# EAGLE design WHRL (EAGLE 7.4.0)
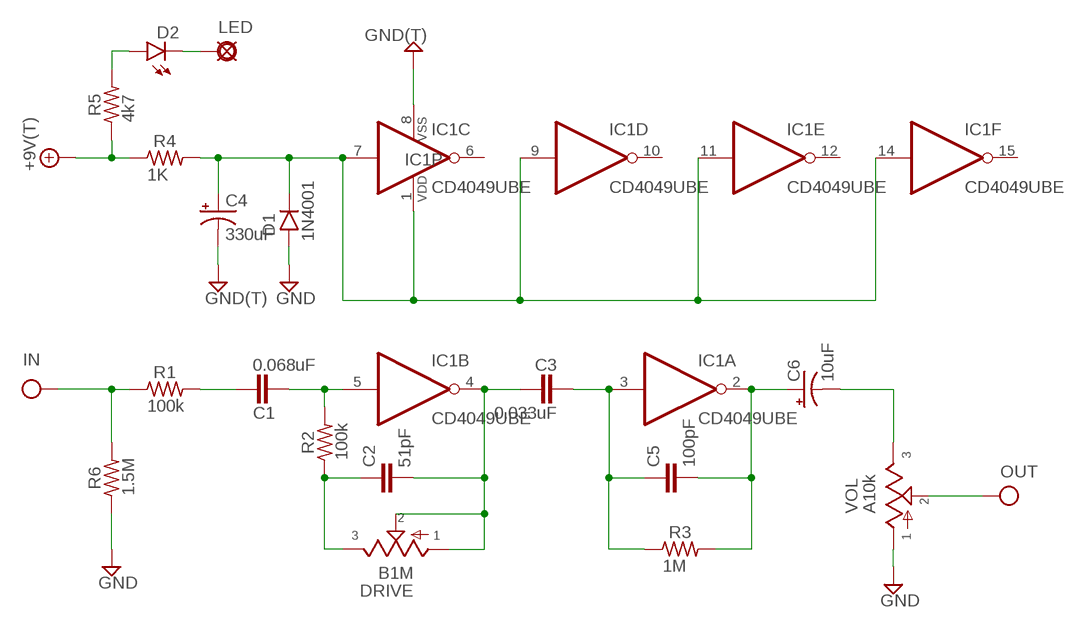
[diagram p0: schematic, sheet 1]

## Parts
+9V  +9V(T)  [SQUARE]
C1  0.068uF  072X0352  [072X035]
C2  51pF  050X030_0251  [050X030_025]
C3  0.033uF  072X0252  [072X025]
C4  330uF  0801  [080_035_1]
C5  100pF  050X030_0251  [050X030_025]
C6  10uF  0501  [050_020_1]
D1  1N4001  1N400X.2  [DO41-2]
D2  LED3MM  [LED3MM]
DRIVE  B1M  9MMPOT_9MM_HOLES  [POT_9MM_HOLES]
G  GND(T)  [SQUARE]
G2  GND(T)  [SQUARE]
IC1  CD4049UBE  [DIL16]
IN  IN(T)  [SQUARE]
LED  PAD  [SQUARE]
OUT  OUT(T)  [SQUARE]
R1  100k  3MM.2  [R0204/2]
R2  100k  3MM.2  [R0204/2]
R3  1M  3MM.2  [R0204/2]
R4  1K  3MM.2  [R0204/2]
R5  4k7  3MM.2  [R0204/2]
R6  1.5M  3MM.2  [R0204/2]
VOL  A10k  9MMPOT_9MM_HOLES  [POT_9MM_HOLES]

## Nets
+9V: +9V.1(+9V) R4.1 R5.1
GND: C4.- D1.A G2.1(GND) G.1(GND) IC1.8(P:VSS) R6.1 VOL.P$1
IN: IN.1(IN) R1.1 R6.2
N$1: C4.+ D1.C IC1.1(P:VDD) IC1.7(C:I) IC1.9(D:I) IC1.11(E:I) IC1.14(F:I) R4.2
N$2: D2.K(C) LED.1(PAD)
N$3: D2.A R5.2
N$4: C1.2 R1.2
N$5: C1.1 IC1.5(B:I) R2.2
N$6: C2.2 C3.1 DRIVE.P$1 DRIVE.P$2 IC1.4(B:O)
N$7: C3.2 C5.1 IC1.3(A:I) R3.1
N$8: C5.2 C6.+ IC1.2(A:O) R3.2
N$9: C6.- VOL.P$3
N$10: OUT.1(OUT) VOL.P$2
N$11: C2.1 DRIVE.P$3 R2.1
Unconnected: IC1.6(C:O) IC1.10(D:O) IC1.12(E:O) IC1.15(F:O)

## Library data of the parts
+9V = mb_supply:+9V(T): +9V Voltage Supply use this to hook up +9v throughout a schematic instead of running wire automatically labels the net "+9v" adds a hookup pad to the circuit board
C1 = mb_caps-box:072X035: 0.15 - 1.0uF; WIMA MKP2 63, 100V: 0.047uF; MKS2 50V: 0.68 - 1.0uF; 63V: 0.33 - 0.47uF; 100V: 0.15 - 0.22uF;
C2 C5 = mb_caps-ceramic:050X030_025: 47 - 120pF Xicon Ceramic Disc 2.5mm lead spacing
C3 = mb_caps-box:072X025: 1000pF - 0.47uF WIMA MKP2 63, 100V: 1000pF - 0.015uF; MKS2 50V: 0.33 - 0.47uF; 63V: 1000pF - 0.22uF;
C4 = mb_caps-electro:080: 47 - 470uF Xicon values at Mouser.com 10V: 330, 470uF; 16V: 220, 330uF; 25V: 220uF; 50V: 47, 100uF
C6 = mb_caps-electro:050: 0.22 - 100uF Xicon values at Mouser.com: 10V: 10 - 100uF; 16V: 2.2 - 47uF; 25V: 0.47 - 47uF; 50V: 0.22 - 22uF
D1 = mb_diodes:1N400X: Rectifier Diodes often used in power supply to prevent damage from reverse polarization
D2 = mb_diodes:LED
DRIVE VOL = mb_9mm Pot:9MM
G G2 = mb_supply:GND(T): Ground use this to hook up ground (GND) throughout a schematic instead of running wire automatically labels the net "GND" adds a hookup pad to the circuit board (you can use several)
IC1 = mb_ics:CD4049UBE: Hex Inverting Buffer Used, for example, in the Red Llama, Three Legged Dog, and Hot Harmonics.
IN = mb_supply:IN(T): Input obsolete: use Pad instead and label net shematic input label with circuit board terminal/pad generally used only once on a schematic (because this device labels the net "IN" in the same way as a voltage supply or ground net)
LED = mb_supply:PAD: PAD use this package for pads with any purpose, including input, output, send or return various pad shapes: round, square, octogonal, long, and long offset
OUT = mb_supply:OUT(T): Output obsolete: use Pad instead and label net output label with circuit board terminal/pad usually appears only once on a schematic
R1-R6 = mb_resistors:3MM: 3mm Resistors Leads spaced 1-6 holes apart for 0.1" perfboard. Suitable for 1/8 watt resistors.

## Board
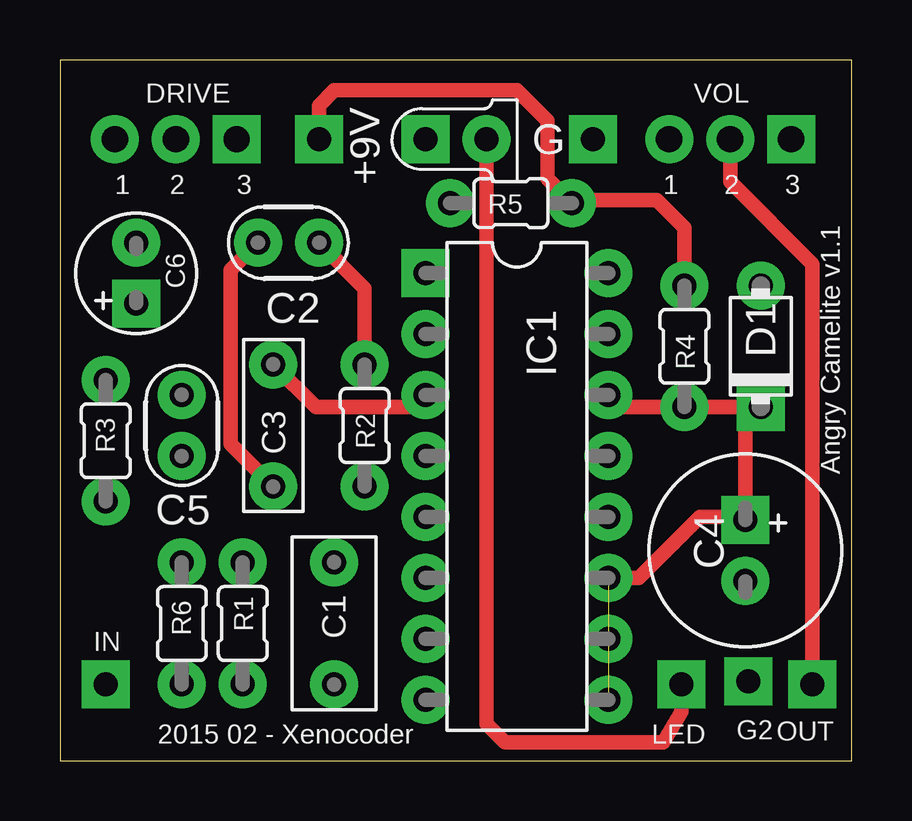
[diagram p1: board, top side]
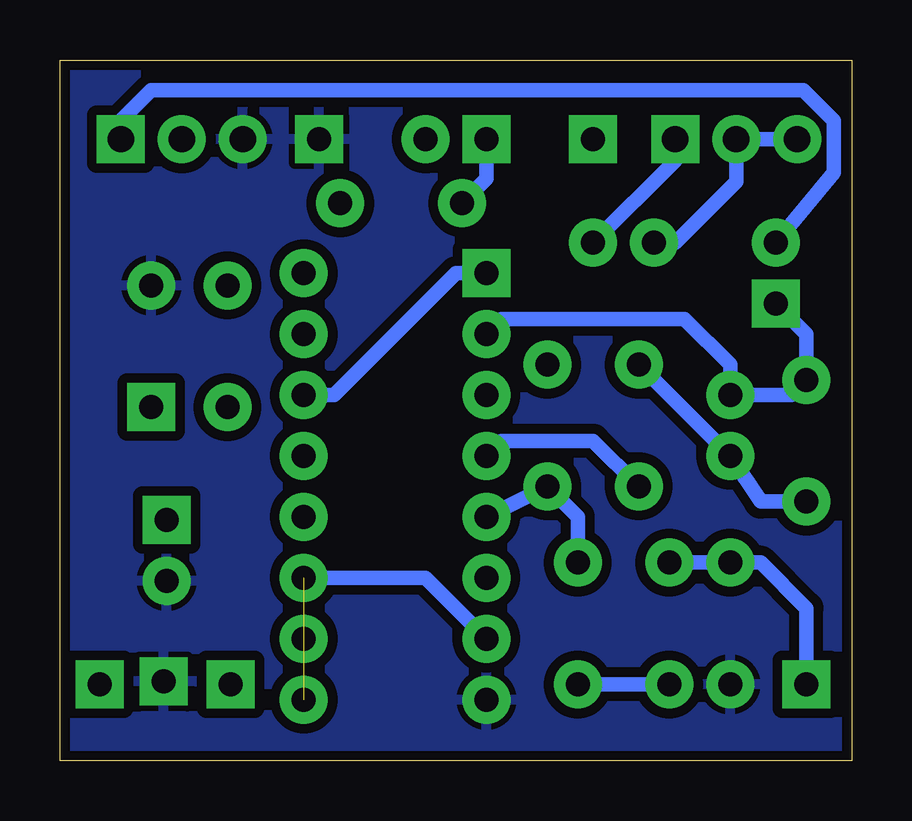
[diagram p2: board, bottom side, seen from below]

Size 33.02 x 29.21 mm. Coordinates in mm from the lower left corner, seen from the top.
Outline: 0,0 33.02,0 33.02,29.21 0,29.21 0,0
Copper layers (1*16): Top 0.0356mm / dielectric 1.5011mm / Bottom 0.0356mm
Design rules "LaenPCBOrder": minimum track width 6mil, minimum drill 13mil, track to track 6mil, track to pad 6mil, pad to pad 6mil, via to via 6mil, smd to smd 6mil, copper to edge 15mil, drill to drill 6mil, minimum pad ring 7mil, minimum via ring 7mil, stop-mask expansion 3mil, vias tented up to drill 0mil, thermal gap 10mil

### Footprints (pad centres in the part's own frame; a part is rotated, then mirrored left to right if it is on the bottom)
SQUARE = drill 1 pad 2 square: 1 0,0
072X035 = drill 1 pad 2: 1 -2.54,0; 2 2.54,0
050X030_025 = drill 1 pad 2: 1 -1.27,0; 2 1.27,0
072X025 = drill 1 pad 2: 1 -2.54,0; 2 2.54,0
080_035_1 = drill 1 pad 2 square: + -1.27,0 | drill 1 pad 2: - 1.27,0
050_020_1 = drill 1 pad 2 square: + -1.27,0 | drill 1 pad 2: - 1.27,0
DO41-2 = drill 1 pad 2: A 2.54,0 | drill 1 pad 2 square: C -2.54,0
LED3MM = drill 1 pad 2 square: A -1.27,0 | drill 1 pad 2: K 1.27,0
POT_9MM_HOLES = drill 1.1 pad 2: P$1 -2.54,0; P$2 0,0 | drill 1.1 pad 2 square: P$3 2.54,0
DIL16 = drill 1 pad 2 square: 1 -8.89,-3.81 | drill 1 pad 2: 2 -6.35,-3.81; 3 -3.81,-3.81; 4 -1.27,-3.81; 5 1.27,-3.81; 6 3.81,-3.81; 7 6.35,-3.81; 8 8.89,-3.81; 9 8.89,3.81; 10 6.35,3.81; 11 3.81,3.81; 12 1.27,3.81; 13 -1.27,3.81; 14 -3.81,3.81; 15 -6.35,3.81; 16 -8.89,3.81
R0204/2 = drill 1 pad 2: 1 -2.54,0; 2 2.54,0

### Placement (x,y rotation side)
+9V  10.79,25.91 0 top
C1  11.43,5.71 270 top
C2  9.53,21.59 180 top
C3  8.89,13.97 90 top
C4  28.57,8.76 270 top
C5  5.08,13.97 90 top
C6  3.17,20.32 90 top
D1  29.21,17.27 90 top
D2  16.51,25.91 0 top
DRIVE  4.83,25.91 0 top
G  22.23,25.91 0 top
G2  28.7,3.3 0 top
IC1  19.05,11.43 270 top
IN  1.91,3.17 0 top
LED  25.91,3.17 0 top
OUT  31.37,3.17 0 top
R1  7.62,5.71 270 top
R2  12.7,13.97 270 top
R3  1.91,13.34 90 top
R4  26.04,17.27 270 top
R5  18.8,23.24 180 top
R6  5.08,5.71 90 top
VOL  27.94,25.91 0 top

### Tracks (layer width: path | path; a pad name or v marks a point on that pad's centre or on a via)
+9V
  Top 0.61: +9V.1 10.79,27.3 11.43,27.94 19.05,27.94 20.32,26.67 20.32,24.26 R5.1 21.46,23.37 24.89,23.37 26.04,22.23 R4.1
GND
  pour Bottom (isolate 0.406): 0,29.21 33.02,29.21 33.02,0 0,0
IN
  Bottom 0.61: R1.1 R6.2 3.81,8.26 1.91,6.35 IN.1
N$1  (1 unrouted)
  Top 0.61: IC1.14 23.37,14.73 R4.2 D1.C 28.57,14.1 C4.+ 28.45,10.16 26.67,10.16 24.13,7.62 IC1.11
  Bottom 0.61: IC1.7 17.78,7.62 IC1.11 | IC1.1 16.51,20.32 21.59,15.24 IC1.14
N$2
  Top 0.61: LED.1 25.91,2.03 25.15,0.76 18.54,0.76 17.78,1.52 D2.K
N$3
  Bottom 0.61: D2.A 15.24,24.26 R5.2
N$4
  Bottom 0.61: R1.2 C1.2
N$5
  Bottom 0.61: C1.1 11.43,10.16 R2.2 IC1.5
N$6
  Top 0.61: C2.2 7.11,20.45 7.11,13.21 C3.1
  Bottom 0.61: C3.1 10.79,13.34 14.61,13.34 IC1.4 | DRIVE.P$1 DRIVE.P$2 4.83,24.13 7.37,21.59 C2.2
N$7
  Top 0.61: C3.2 10.67,14.73 14.73,14.73 IC1.3
  Bottom 0.61: R3.1 3.81,10.79 C5.1 C3.2
N$8
  Bottom 0.61: C6.+ 1.91,17.78 R3.2 2.54,15.24 C5.2 5.08,16.51 6.99,18.41 14.61,18.41 IC1.2
N$9
  Bottom 0.61: C6.- 0.76,24.51 0.76,26.67 2.03,27.94 29.21,27.94 30.48,26.67 VOL.P$3
N$10
  Top 0.61: OUT.1 31.37,20.7 27.94,24.13 VOL.P$2
N$11
  Top 0.61: R2.1 12.7,19.68 C2.1
  Bottom 0.61: C2.1 7.37,25.02 DRIVE.P$3

### Text on the board
tNames: DRIVE | VOL | 1 | 2 | 3 | 1 | 2 | 3 | Angry Camelite v1.1 | 2015 02 - Xenocoder